# Altium schematic sheet SML-230109PCB1__LCD.SchDoc
size A4; DocumentNumber: 4; SheetNumber: 4; SheetTotal: 6
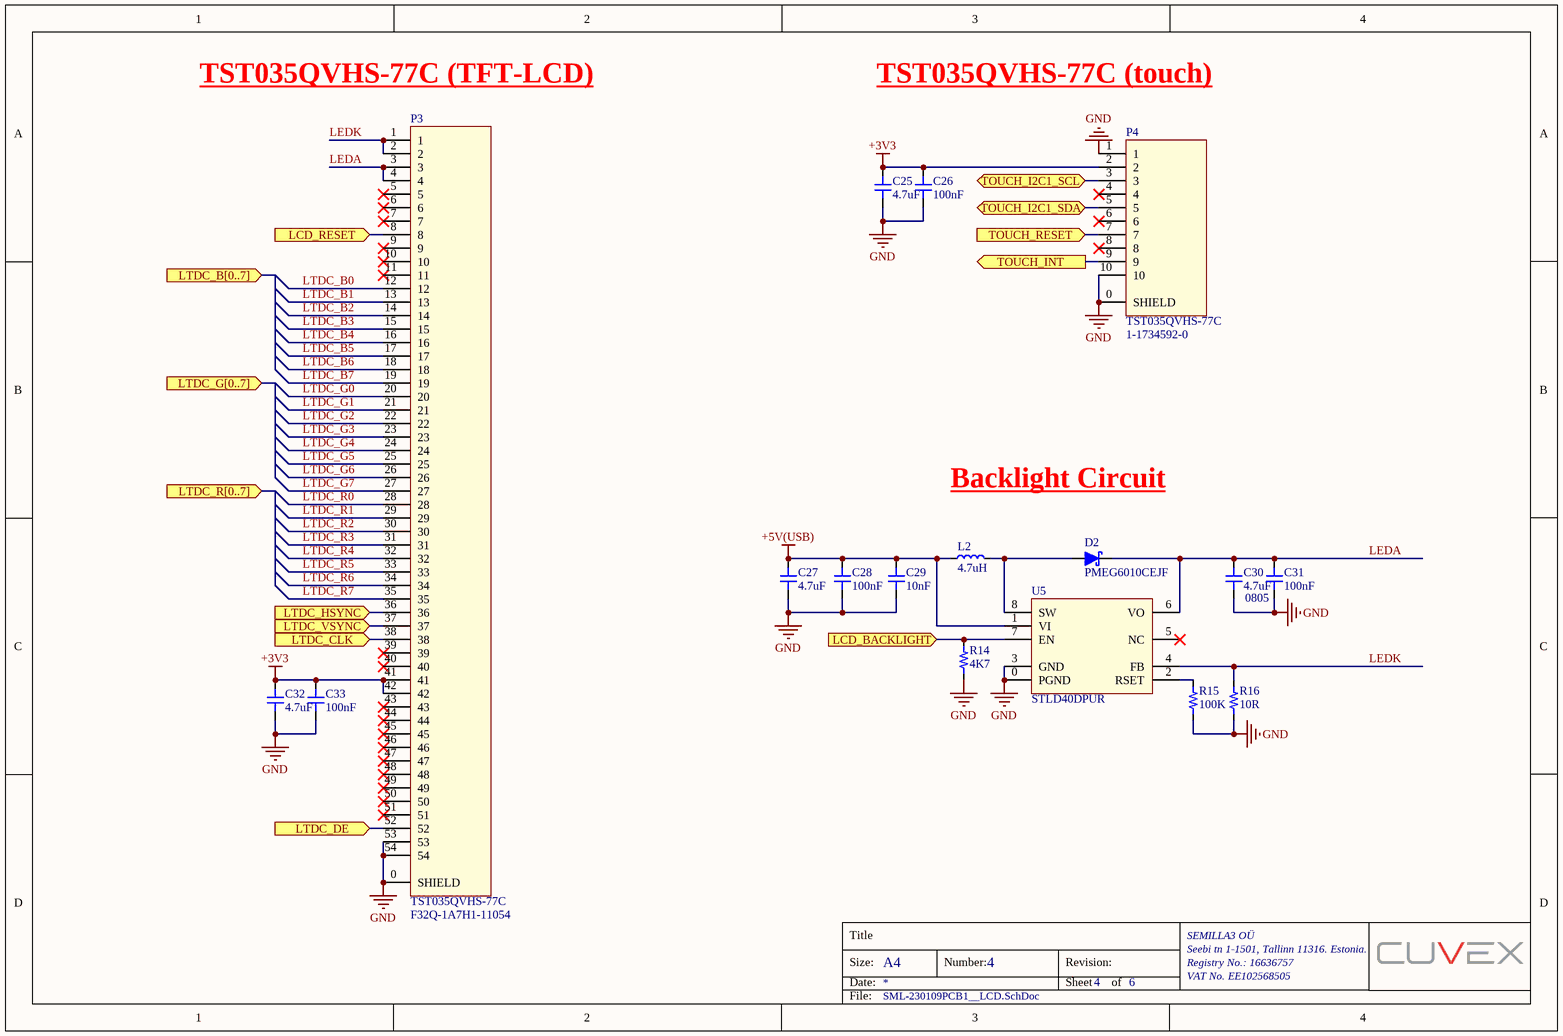
[diagram p0: SML-230109PCB1__LCD.SchDoc]

## Parts
C25  value 4.7uF  [[G] CAP-MLCC__0603]  (hidden comment: .)
C26  value 100nF  [[G] CAP-MLCC__0603]  (hidden comment: .)
C27  value 4.7uF  [[G] CAP-MLCC__0603]  (hidden comment: .)
C28  value 100nF  [[G] CAP-MLCC__0603]  (hidden comment: .)
C29  value 10nF  [[G] CAP-MLCC__0603]  (hidden comment: .)
C30  value 4.7uF  [06] - Package: 0805  [[G] CAP-MLCC__0805]  (hidden comment: .)
C31  value 100nF  [[G] CAP-MLCC__0603]  (hidden comment: .)
C32  value 4.7uF  [[G] CAP-MLCC__0603]  (hidden comment: .)
C33  value 100nF  [[G] CAP-MLCC__0603]  (hidden comment: .)
D2  .  [[G] SOD-323__W]  (value not drawn)
L2  value 4.7uH  [IND__LQH32PH__3'2x2'5x1'55mm]  (hidden comment: .)
P3  TFT-LCD: TST035QVHS-77C  [CONN-FFC/FPC__AMPHENOL__54P-TOP__F32Q-1A7H1-11054__INV]  (hidden comment: .)
P4  TFT-LCD: TST035QVHS-77C  [CONN-FFC/FPC__TE__10P-BOT__1-1734592-0__INV]  (hidden comment: .)
R14  value 4K7  [[G] RES-CHIP__0603]  (hidden comment: .)
R15  value 100K  [[G] RES-CHIP__0603]  (hidden comment: .)
R16  value 10R  [[G] RES-CHIP__0603]  (hidden comment: .)
U5  .  [IC-DRV-LED__STLD40DPUR__QFN-8(3X3)]  (value not drawn)

## Ports
LCD_BACKLIGHT (in, see 3[1A]), LCD_RESET (in, see 3[1A]), LTDC_B[0..7] (in, see 3[1B]), LTDC_CLK (in, see 3[1B]), LTDC_DE (in, see 3[1B]), LTDC_G[0..7] (in, see 3[1B]), LTDC_HSYNC (in, see 3[1B]), LTDC_R[0..7] (in, see 3[1B]), LTDC_VSYNC (in, see 3[1A]), TOUCH_I2C1_SCL (bidir, see 3[1A]), TOUCH_I2C1_SDA (bidir, see 3[1A]), TOUCH_INT (out, see 3[1A]), TOUCH_RESET (in, see 3[1A])

## Nets
+3V3: C25.2 C26.2 C32.2 C33.2 P3.41 P3.42 P4.2
+5V(USB): C27.2 C28.2 C29.2 L2.1 U5.1(VI)
GND: C25.1 C26.1 C27.1 C28.1 C29.1 C30.1 C31.1 C32.1 C33.1 P3.0(SHIELD) P3.53 P3.54 P4.0(SHIELD) P4.1 P4.10 R14.2 R15.1 R16.1 U5.0(PGND) U5.3(GND)
LCD_BACKLIGHT: R14.1 U5.7(EN) ; port LCD_BACKLIGHT
LCD_RESET: P3.8 ; port LCD_RESET
LEDA: C30.2 C31.2 D2.K P3.3 P3.4 U5.6(VO)
LEDK: P3.1 P3.2 R16.2 U5.4(FB)
LTDC_B0: P3.12
LTDC_B1: P3.13
LTDC_B2: P3.14
LTDC_B3: P3.15
LTDC_B4: P3.16
LTDC_B5: P3.17
LTDC_B6: P3.18
LTDC_B7: P3.19
LTDC_CLK: P3.38 ; port LTDC_CLK
LTDC_DE: P3.52 ; port LTDC_DE
LTDC_G0: P3.20
LTDC_G1: P3.21
LTDC_G2: P3.22
LTDC_G3: P3.23
LTDC_G4: P3.24
LTDC_G5: P3.25
LTDC_G6: P3.26
LTDC_G7: P3.27
LTDC_HSYNC: P3.36 ; port LTDC_HSYNC
LTDC_R0: P3.28
LTDC_R1: P3.29
LTDC_R2: P3.30
LTDC_R3: P3.31
LTDC_R4: P3.32
LTDC_R5: P3.33
LTDC_R6: P3.34
LTDC_R7: P3.35
LTDC_VSYNC: P3.37 ; port LTDC_VSYNC
TOUCH_I2C1_SCL: P4.3 ; port TOUCH_I2C1_SCL
TOUCH_I2C1_SDA: P4.5 ; port TOUCH_I2C1_SDA
TOUCH_INT: P4.9 ; port TOUCH_INT
TOUCH_RESET: P4.7 ; port TOUCH_RESET
NetD2_A: D2.A L2.2 U5.8(SW)
NetR15_2: R15.2 U5.2(RSET)

Not connected (* = marked no-connect by the designer): P3 5* 6* 7* 9* 10* 11* 39* 40* 43* 44* 45* 46* 47* 48* 49* 50* 51*; P4 4* 6* 8*; U5 5(NC)*

## Notes on the sheet
- (near P3) TST035QVHS-77C (TFT-LCD)
- TST035QVHS-77C (touch)
- Backlight Circuit
- Title
- Size:
- Date:
- A4
- Number:
- Revision:
- Sheet
- of
- SEMILLA3 OÜ
- Seebi tn 1-1501, Tallinn 11316. Estonia.
- Registry No.: 16636757
- VAT No. EE102568505
- File:

## Library data of the parts
C25 C27 C32 = CAP_MLCC_0603: CAP MLCC 0603; [00] - Description (BOM): CAP MLCC 4.7uF 0603 010; [04] - Power features: 010; STAR Code: C4.7uF0603010; [06] - Package: 0603; [01] - MPN Code: *; [02] - Manufacturer: *; [03] - Datasheet: *; [05] - Temperature range: *; [07] - PVP Dealer name: *; [08] - PVP 1K: *; Voltage: 010
C26 C28 C33 = CAP_MLCC_0603: CAP MLCC 0603; [00] - Description (BOM): CAP MLCC 100nF 0603 010; [04] - Power features: 010; STAR Code: C100nF0603010; [06] - Package: 0603; [01] - MPN Code: *; [02] - Manufacturer: *; [03] - Datasheet: *; [05] - Temperature range: *; [07] - PVP Dealer name: *; [08] - PVP 1K: *; Voltage: 010
C29 = CAP_MLCC_0603: CAP MLCC 0603; [00] - Description (BOM): CAP MLCC 10nF 0603 010; [04] - Power features: 010; STAR Code: C10nF0603010; [06] - Package: 0603; [01] - MPN Code: *; [02] - Manufacturer: *; [03] - Datasheet: *; [05] - Temperature range: *; [07] - PVP Dealer name: *; [08] - PVP 1K: *; Voltage: 010
C30 = CAP_MLCC_0805: CAP MLCC 0805; [00] - Description (BOM): CAP MLCC 4.7uF 0805 050; [04] - Power features: 050; STAR Code: C4.7uF0805050; [01] - MPN Code: *; [02] - Manufacturer: *; [03] - Datasheet: *; [05] - Temperature range: *; [07] - PVP Dealer name: *; [08] - PVP 1K: *; Voltage: 050
C31 = CAP_MLCC_0603: CAP MLCC 0603; [00] - Description (BOM): CAP MLCC 100nF 0603 050; [04] - Power features: 050; STAR Code: C100nF0603050; [06] - Package: 0603; [01] - MPN Code: *; [02] - Manufacturer: *; [03] - Datasheet: *; [05] - Temperature range: *; [07] - PVP Dealer name: *; [08] - PVP 1K: *; Voltage: 050
D2 = PMEG6010CEJF: DIODE SCHOTTKY & RECTIFIER, SOD-323F, Vf=570mV, If=1A, Vr=60V, Ir=50uA; [02] - Manufacturer: Nexperia; [05] - Temperature range: -65 to +150 ºC; [00] - Description (BOM): DIODE SCHOTTKY & RECTIFIER, SOD-323F, Vf=570mV, If=1A, Vr=60V, Ir=50uA; [03] - Datasheet: https://www.mouser.es/datasheet/2/916/PMEG6010CEH_PMEG6010CEJ-1319617.pdf; [04] - Power features: Vf=570mV, If=1A, Vr=60V, Ir=50uA; [06] - Package: SOD-323F; [07] - PVP Dealer name: *; [08] - PVP 1K: *; STAR Code: *; [01] - MPN Code: PMEG6010CEJF
L2 = LQH32PH4R7NN0L: IND Murata, LQH32PHxxx, 4'7uH; [04] - Power features: Iccmáx=1A, Rccmáx=180mohm, 30%; [05] - Temperature range: -40 to +125 ºC; [06] - Package: LQH32PHxxx (3.2x2.5mm); [00] - Description (BOM): IND Murata, LQH32PHxxx, 4'7uH; [02] - Manufacturer: Murata; [03] - Datasheet: https://www.mouser.mx/datasheet/2/281/1/JELF243A_9136-1699509.pdf; [07] - PVP Dealer name: *; [08] - PVP 1K: *; STAR Code: *; [01] - MPN Code: LQH32PH4R7NN0L
P3 = F32Q-1A7H1-11054: CONN FFC/FPC, AMPHENOL, right angle, 54pin (0'5mm), top contact; [04] - Power features: V=50Vac/dc, I=±500mA; [05] - Temperature range: -40 to +105 ºC; [06] - Package: 34'3 x 5'5 x 2 mm; [00] - Description (BOM): CONN FFC/FPC, AMPHENOL, right angle, 54pin (0'5mm), top contact; [02] - Manufacturer: Amphenol; [03] - Datasheet: https://cdn.amphenol-cs.com/media/wysiwyg/files/documentation/datasheet/flex/ffc_fpc_050mm_f32r_f32q.pdf; [07] - PVP Dealer name: *; [08] - PVP 1K: *; STAR Code: *; [01] - MPN Code: F32Q-1A7H1-11054
P4 = 1-1734592-0: CONN FFC/FPC, TE, right angle, 10pin (0'5mm), bot contact; [02] - Manufacturer: TE Connectivity; [04] - Power features: V=250Vac/dc, I=500mA; [05] - Temperature range: -40 to +85 ºC; [06] - Package: 10'43 x 5'1 x 2 mm; [00] - Description (BOM): CONN FFC/FPC, TE, right angle, 10pin (0'5mm), bot contact; [03] - Datasheet: https://www.te.com/commerce/DocumentDelivery/DDEController?Action=showdoc&DocId=Customer+Drawing%7F1734839%7FC%7Fpdf%7FEnglish%7FENG_CD_1734839_C_C_1734839.pdf%7F1-1734839-0; [07] - PVP Dealer name: *; [08] - PVP 1K: *; STAR Code: *; [01] - MPN Code: 1-1734592-0
R14 = RES_SMD_0603: RES SMD 0603 [G]; [00] - Description (BOM): RES 4K7 OHM 0603 1% 1/10W; [04] - Power features: 100mW; STAR Code: 4K706031%; Tolerance: 1%; [06] - Package: 0603; [01] - MPN Code: *; [02] - Manufacturer: *; [03] - Datasheet: *; [05] - Temperature range: *; [07] - PVP Dealer name: *; [08] - PVP 1K: *
R15 = RES_SMD_0603: RES SMD 0603 [G]; [00] - Description (BOM): RES 100K OHM 0603 1% 1/10W; [04] - Power features: 100mW; STAR Code: 100K06031%; Tolerance: 1%; [06] - Package: 0603; [01] - MPN Code: *; [02] - Manufacturer: *; [03] - Datasheet: *; [05] - Temperature range: *; [07] - PVP Dealer name: *; [08] - PVP 1K: *
R16 = RES_SMD_0603: RES SMD 0603 [G]; [00] - Description (BOM): RES 10R OHM 0603 1% 1/10W; [04] - Power features: 100mW; STAR Code: 10R06031%; Tolerance: 1%; [06] - Package: 0603; [01] - MPN Code: *; [02] - Manufacturer: *; [03] - Datasheet: *; [05] - Temperature range: *; [07] - PVP Dealer name: *; [08] - PVP 1K: *
U5 = STLD40DPUR: IC DRV LED BOOST, 1 output, Vdd=3'00-5'5V, Vout≤37V, Iout=20mA; [02] - Manufacturer: ST Microelectronics; [05] - Temperature range: -40 to +85 ºC; [06] - Package: QFN-8(3x3); [00] - Description (BOM): IC DRV LED BOOST, 1 output, Vdd=3'00-5'5V, Vout≤37V, Iout=20mA; [03] - Datasheet: https://www.mouser.es/datasheet/2/389/stld40d-1850966.pdf; [04] - Power features: Vdd=3'00-5'5V, Vout≤37V, Iout=20mA; [07] - PVP Dealer name: *; [08] - PVP 1K: *; STAR Code: *; [01] - MPN Code: STLD40DPUR